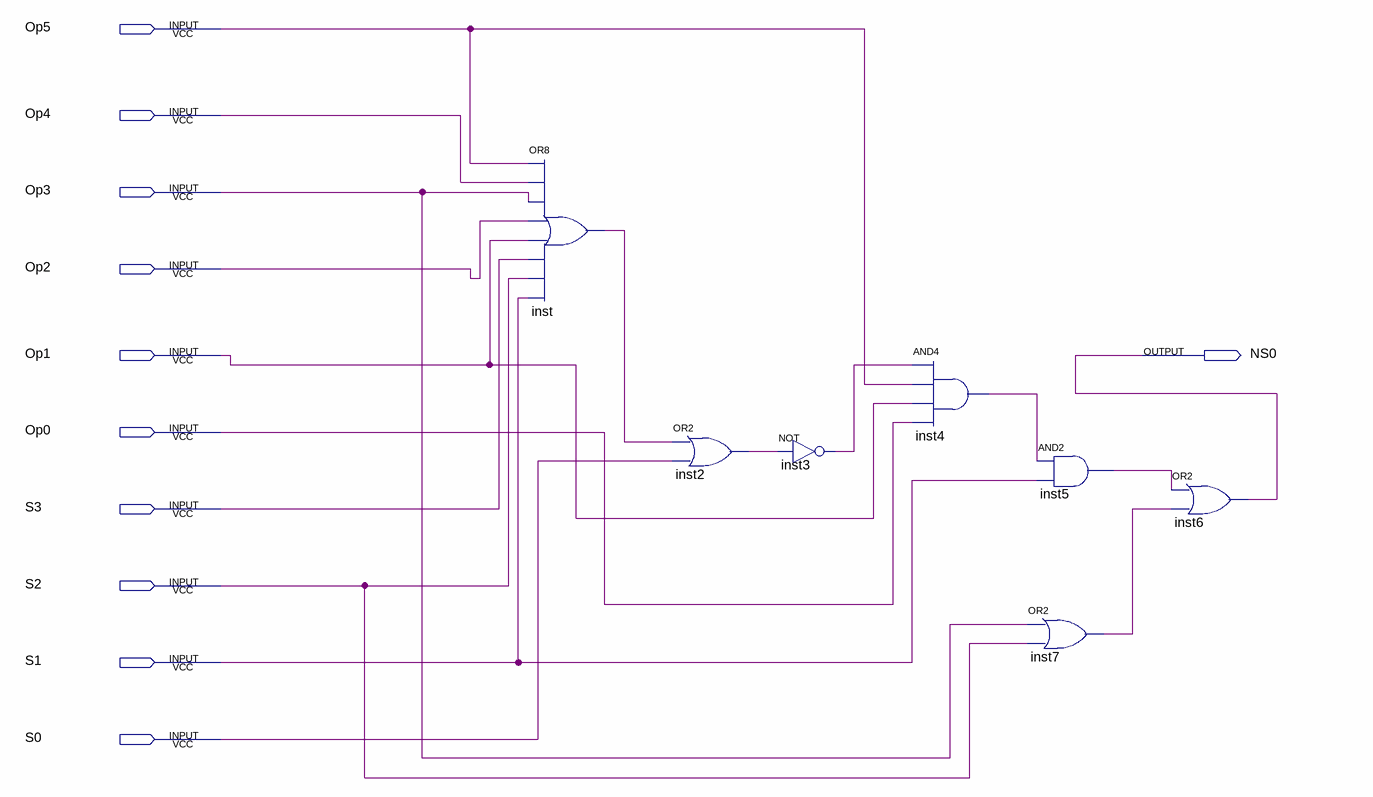
[diagram p0: schematic sheet]
// Quartus schematic NS0.bdf as structural Verilog: 7 symbols, 11 pins
module NS0 (
  input  Op5,
  input  Op4,
  input  Op3,
  input  Op2,
  input  Op1,
  input  Op0,
  input  S3,
  input  S2,
  input  S1,
  input  S0,
  output NS0
);

  wire inst2_out, inst3_out, inst4_out, inst5_out, inst7_out, inst_out;

  or inst (inst_out, Op5, Op4, Op3, Op2, Op1, S3, S2, S1);
  or inst2 (inst2_out, inst_out, S0);
  not inst3 (inst3_out, inst2_out);
  and inst4 (inst4_out, inst3_out, Op5, Op1, Op0);
  and inst5 (inst5_out, inst4_out, S1);
  or inst7 (inst7_out, Op3, S2);
  or inst6 (NS0, inst5_out, inst7_out);
endmodule
